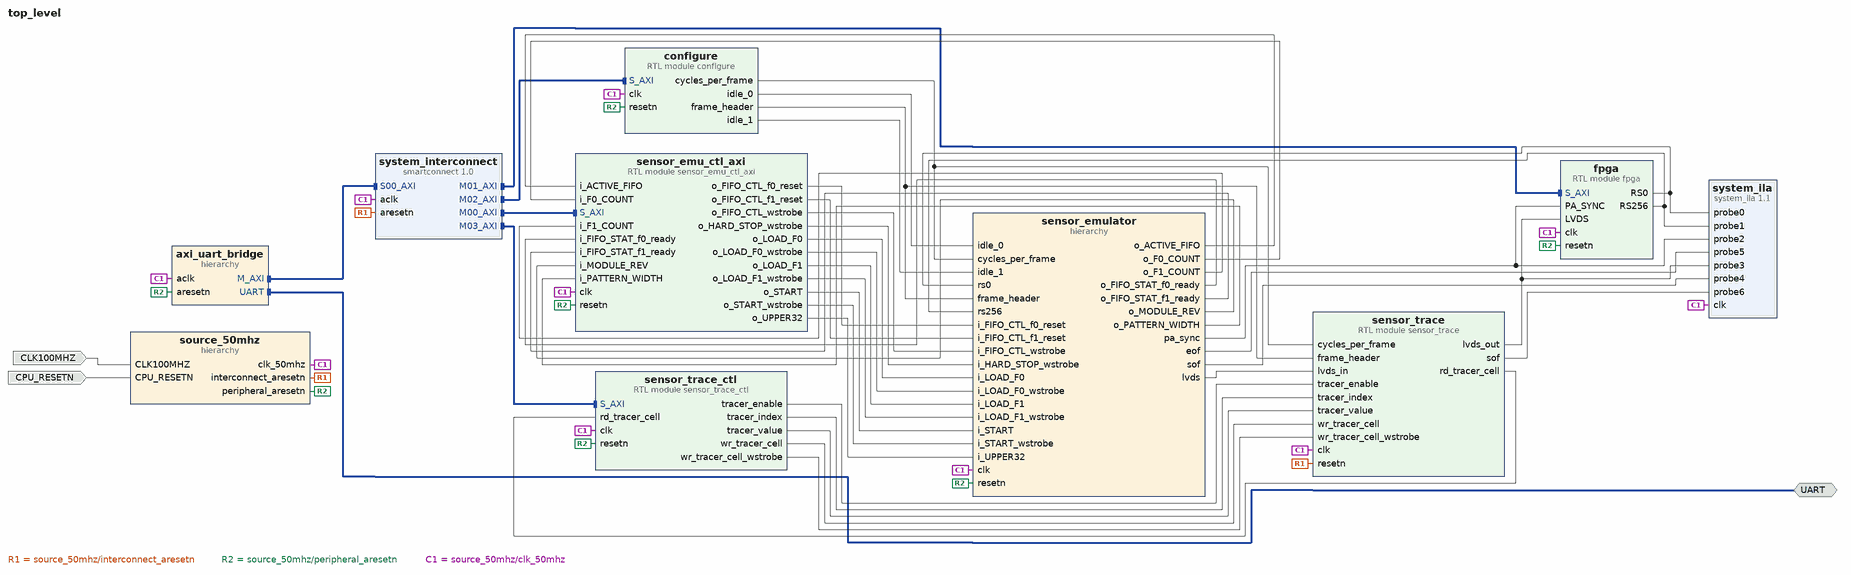
[diagram p0: block diagram of the top level]
# Vivado block design top_level, xc7a100tcsg324-1, Vivado 2021.1
create_bd_design top_level

create_bd_intf_port -mode Master -vlnv xilinx.com:interface:uart_rtl:1.0 UART
create_bd_port -dir I -type clk CLK100MHZ
set_property -dict {CONFIG.ASSOCIATED_RESET CPU_RESETN} [get_bd_ports CLK100MHZ]
create_bd_port -dir I -type rst CPU_RESETN

create_bd_cell -type hier source_50mhz
create_bd_cell -type hier axi_uart_bridge
create_bd_cell -type hier sensor_emulator
create_bd_cell -type module -reference fpga fpga
create_bd_cell -type ip -vlnv xilinx.com:ip:system_ila:1.1 system_ila
set_property -dict [list \
  CONFIG.C_DATA_DEPTH 2048 \
  CONFIG.C_MON_TYPE NATIVE \
  CONFIG.C_NUM_OF_PROBES 7 \
  CONFIG.C_PROBE_WIDTH_PROPAGATION AUTO \
  CONFIG.C_SLOT_0_INTF_TYPE xilinx.com:interface:axis_rtl:1.0 \
] [get_bd_cells system_ila]
create_bd_cell -type module -reference configure configure
create_bd_cell -type module -reference sensor_emu_ctl_axi sensor_emu_ctl_axi
create_bd_cell -type ip -vlnv xilinx.com:ip:smartconnect:1.0 system_interconnect
set_property -dict {CONFIG.NUM_MI 4 CONFIG.NUM_SI 1} [get_bd_cells system_interconnect]
create_bd_cell -type module -reference sensor_trace sensor_trace
create_bd_cell -type module -reference sensor_trace_ctl sensor_trace_ctl

# ---- hierarchy /source_50mhz ----
current_bd_instance /source_50mhz
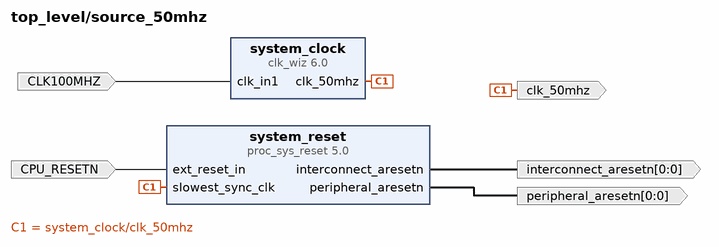
[diagram p1: block diagram inside /source_50mhz]
create_bd_pin -dir I -type clk CLK100MHZ
create_bd_pin -dir O -type clk clk_50mhz
create_bd_pin -dir I -type rst CPU_RESETN
create_bd_pin -dir O -from 0 -to 0 -type rst interconnect_aresetn
create_bd_pin -dir O -from 0 -to 0 -type rst peripheral_aresetn

create_bd_cell -type ip -vlnv xilinx.com:ip:clk_wiz:6.0 system_clock
set_property -dict [list \
  CONFIG.CLKOUT1_DRIVES BUFGCE \
  CONFIG.CLKOUT1_JITTER 151.636 \
  CONFIG.CLKOUT1_REQUESTED_OUT_FREQ 50 \
  CONFIG.CLKOUT2_DRIVES BUFGCE \
  CONFIG.CLKOUT3_DRIVES BUFGCE \
  CONFIG.CLKOUT4_DRIVES BUFGCE \
  CONFIG.CLKOUT5_DRIVES BUFGCE \
  CONFIG.CLKOUT6_DRIVES BUFGCE \
  CONFIG.CLKOUT7_DRIVES BUFGCE \
  CONFIG.CLK_OUT1_PORT clk_50mhz \
  CONFIG.FEEDBACK_SOURCE FDBK_AUTO \
  CONFIG.MMCM_CLKOUT0_DIVIDE_F 20.000 \
  CONFIG.USE_LOCKED false \
  CONFIG.USE_RESET false \
  CONFIG.USE_SAFE_CLOCK_STARTUP true \
] [get_bd_cells system_clock]
create_bd_cell -type ip -vlnv xilinx.com:ip:proc_sys_reset:5.0 system_reset

# ---- hierarchy /axi_uart_bridge ----
current_bd_instance /axi_uart_bridge
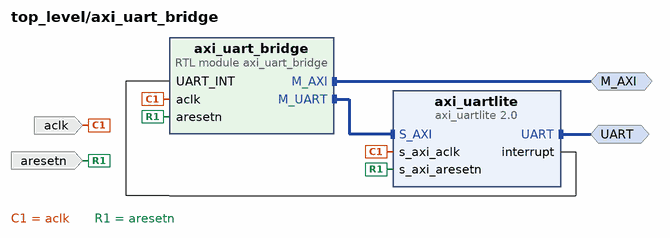
[diagram p2: block diagram inside /axi_uart_bridge]
create_bd_intf_pin -mode Master -vlnv xilinx.com:interface:aximm_rtl:1.0 M_AXI
create_bd_intf_pin -mode Master -vlnv xilinx.com:interface:uart_rtl:1.0 UART
create_bd_pin -dir I -type rst aresetn
create_bd_pin -dir I -type clk aclk

create_bd_cell -type module -reference axi_uart_bridge axi_uart_bridge
create_bd_cell -type ip -vlnv xilinx.com:ip:axi_uartlite:2.0 axi_uartlite
set_property -dict {CONFIG.C_BAUDRATE 115200 CONFIG.C_S_AXI_ACLK_FREQ_HZ 50000000} [get_bd_cells axi_uartlite]

# ---- hierarchy /sensor_emulator ----
current_bd_instance /sensor_emulator
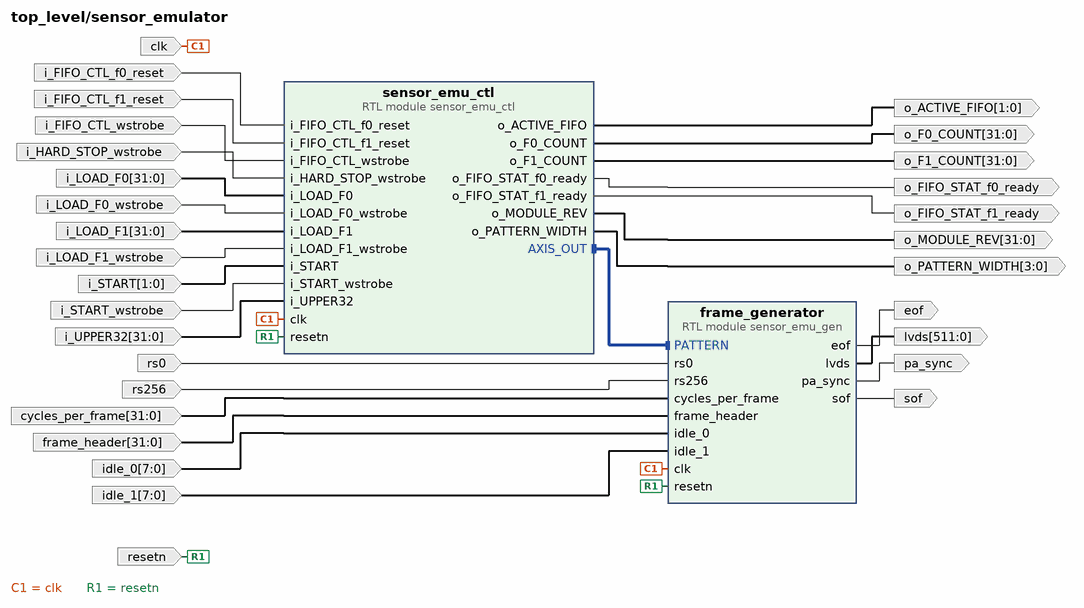
[diagram p3: block diagram inside /sensor_emulator]
create_bd_pin -dir I -type rst resetn
create_bd_pin -dir I -type clk clk
create_bd_pin -dir I rs256
create_bd_pin -dir O pa_sync
create_bd_pin -dir O -from 511 -to 0 lvds
create_bd_pin -dir I rs0
create_bd_pin -dir O sof
create_bd_pin -dir O eof
create_bd_pin -dir I -from 31 -to 0 cycles_per_frame
create_bd_pin -dir I -from 7 -to 0 idle_0
create_bd_pin -dir I -from 7 -to 0 idle_1
create_bd_pin -dir I -from 31 -to 0 frame_header
create_bd_pin -dir I -type rst i_FIFO_CTL_f0_reset
create_bd_pin -dir I -type rst i_FIFO_CTL_f1_reset
create_bd_pin -dir I i_FIFO_CTL_wstrobe
create_bd_pin -dir I -from 31 -to 0 i_UPPER32
create_bd_pin -dir I -from 31 -to 0 i_LOAD_F0
create_bd_pin -dir I i_LOAD_F0_wstrobe
create_bd_pin -dir I -from 31 -to 0 i_LOAD_F1
create_bd_pin -dir I i_LOAD_F1_wstrobe
create_bd_pin -dir I -from 1 -to 0 i_START
create_bd_pin -dir I i_START_wstrobe
create_bd_pin -dir I i_HARD_STOP_wstrobe
create_bd_pin -dir O -from 31 -to 0 o_MODULE_REV
create_bd_pin -dir O -type rst o_FIFO_STAT_f0_ready
create_bd_pin -dir O -type rst o_FIFO_STAT_f1_ready
create_bd_pin -dir O -from 31 -to 0 o_F0_COUNT
create_bd_pin -dir O -from 31 -to 0 o_F1_COUNT
create_bd_pin -dir O -from 1 -to 0 o_ACTIVE_FIFO
create_bd_pin -dir O -from 3 -to 0 o_PATTERN_WIDTH

create_bd_cell -type module -reference sensor_emu_ctl sensor_emu_ctl
create_bd_cell -type module -reference sensor_emu_gen frame_generator

# ---- connections ----

current_bd_instance /source_50mhz
connect_bd_net [get_bd_pins CLK100MHZ] [get_bd_pins system_clock/clk_in1]
connect_bd_net [get_bd_pins CPU_RESETN] [get_bd_pins system_reset/ext_reset_in]
connect_bd_net -net system_clock_clk_100mhz [get_bd_pins system_clock/clk_50mhz] [get_bd_pins clk_50mhz] [get_bd_pins system_reset/slowest_sync_clk]
connect_bd_net [get_bd_pins system_reset/interconnect_aresetn] [get_bd_pins interconnect_aresetn]
connect_bd_net [get_bd_pins system_reset/peripheral_aresetn] [get_bd_pins peripheral_aresetn]

current_bd_instance /axi_uart_bridge
connect_bd_intf_net [get_bd_intf_pins M_AXI] [get_bd_intf_pins axi_uart_bridge/M_AXI]
connect_bd_intf_net [get_bd_intf_pins UART] [get_bd_intf_pins axi_uartlite/UART]
connect_bd_intf_net [get_bd_intf_pins axi_uart_bridge/M_UART] [get_bd_intf_pins axi_uartlite/S_AXI]
connect_bd_net [get_bd_pins aclk] [get_bd_pins axi_uart_bridge/aclk] [get_bd_pins axi_uartlite/s_axi_aclk]
connect_bd_net [get_bd_pins aresetn] [get_bd_pins axi_uart_bridge/aresetn] [get_bd_pins axi_uartlite/s_axi_aresetn]
connect_bd_net [get_bd_pins axi_uartlite/interrupt] [get_bd_pins axi_uart_bridge/UART_INT]

current_bd_instance /sensor_emulator
connect_bd_intf_net -intf_net sensor_emu_ctl_0_AXIS_OUT [get_bd_intf_pins sensor_emu_ctl/AXIS_OUT] [get_bd_intf_pins frame_generator/PATTERN]
connect_bd_net -net LVDS [get_bd_pins frame_generator/lvds] [get_bd_pins lvds]
connect_bd_net -net PA_SYNC [get_bd_pins frame_generator/pa_sync] [get_bd_pins pa_sync]
connect_bd_net [get_bd_pins rs0] [get_bd_pins frame_generator/rs0]
connect_bd_net [get_bd_pins rs256] [get_bd_pins frame_generator/rs256]
connect_bd_net [get_bd_pins clk] [get_bd_pins sensor_emu_ctl/clk] [get_bd_pins frame_generator/clk]
connect_bd_net -net cycles_per_frame1_1 [get_bd_pins cycles_per_frame] [get_bd_pins frame_generator/cycles_per_frame]
connect_bd_net [get_bd_pins frame_generator/eof] [get_bd_pins eof]
connect_bd_net [get_bd_pins frame_generator/sof] [get_bd_pins sof]
connect_bd_net [get_bd_pins frame_header] [get_bd_pins frame_generator/frame_header]
connect_bd_net [get_bd_pins i_FIFO_CTL_f0_reset] [get_bd_pins sensor_emu_ctl/i_FIFO_CTL_f0_reset]
connect_bd_net [get_bd_pins i_FIFO_CTL_f1_reset] [get_bd_pins sensor_emu_ctl/i_FIFO_CTL_f1_reset]
connect_bd_net [get_bd_pins i_FIFO_CTL_wstrobe] [get_bd_pins sensor_emu_ctl/i_FIFO_CTL_wstrobe]
connect_bd_net [get_bd_pins i_HARD_STOP_wstrobe] [get_bd_pins sensor_emu_ctl/i_HARD_STOP_wstrobe]
connect_bd_net -net i_LOAD_F0_1 [get_bd_pins i_LOAD_F0] [get_bd_pins sensor_emu_ctl/i_LOAD_F0]
connect_bd_net [get_bd_pins i_LOAD_F0_wstrobe] [get_bd_pins sensor_emu_ctl/i_LOAD_F0_wstrobe]
connect_bd_net -net i_LOAD_F1_1 [get_bd_pins i_LOAD_F1] [get_bd_pins sensor_emu_ctl/i_LOAD_F1]
connect_bd_net [get_bd_pins i_LOAD_F1_wstrobe] [get_bd_pins sensor_emu_ctl/i_LOAD_F1_wstrobe]
connect_bd_net [get_bd_pins i_START] [get_bd_pins sensor_emu_ctl/i_START]
connect_bd_net [get_bd_pins i_START_wstrobe] [get_bd_pins sensor_emu_ctl/i_START_wstrobe]
connect_bd_net -net i_UPPER32_1 [get_bd_pins i_UPPER32] [get_bd_pins sensor_emu_ctl/i_UPPER32]
connect_bd_net -net idle_0_1 [get_bd_pins idle_0] [get_bd_pins frame_generator/idle_0]
connect_bd_net -net idle_1_1 [get_bd_pins idle_1] [get_bd_pins frame_generator/idle_1]
connect_bd_net [get_bd_pins resetn] [get_bd_pins sensor_emu_ctl/resetn] [get_bd_pins frame_generator/resetn]
connect_bd_net [get_bd_pins sensor_emu_ctl/o_ACTIVE_FIFO] [get_bd_pins o_ACTIVE_FIFO]
connect_bd_net [get_bd_pins sensor_emu_ctl/o_F0_COUNT] [get_bd_pins o_F0_COUNT]
connect_bd_net [get_bd_pins sensor_emu_ctl/o_F1_COUNT] [get_bd_pins o_F1_COUNT]
connect_bd_net -net sensor_emu_ctl_o_FIFO_STAT_f0_reset [get_bd_pins sensor_emu_ctl/o_FIFO_STAT_f0_ready] [get_bd_pins o_FIFO_STAT_f0_ready]
connect_bd_net -net sensor_emu_ctl_o_FIFO_STAT_f1_reset [get_bd_pins sensor_emu_ctl/o_FIFO_STAT_f1_ready] [get_bd_pins o_FIFO_STAT_f1_ready]
connect_bd_net [get_bd_pins sensor_emu_ctl/o_MODULE_REV] [get_bd_pins o_MODULE_REV]
connect_bd_net [get_bd_pins sensor_emu_ctl/o_PATTERN_WIDTH] [get_bd_pins o_PATTERN_WIDTH]

current_bd_instance /
connect_bd_intf_net -intf_net hier_0_M_AXI [get_bd_intf_pins system_interconnect/S00_AXI] [get_bd_intf_pins axi_uart_bridge/M_AXI]
connect_bd_intf_net -intf_net hier_0_UART [get_bd_intf_ports UART] [get_bd_intf_pins axi_uart_bridge/UART]
connect_bd_intf_net [get_bd_intf_pins system_interconnect/M00_AXI] [get_bd_intf_pins sensor_emu_ctl_axi/S_AXI]
connect_bd_intf_net [get_bd_intf_pins system_interconnect/M01_AXI] [get_bd_intf_pins fpga/S_AXI]
connect_bd_intf_net [get_bd_intf_pins system_interconnect/M02_AXI] [get_bd_intf_pins configure/S_AXI]
connect_bd_intf_net [get_bd_intf_pins system_interconnect/M03_AXI] [get_bd_intf_pins sensor_trace_ctl/S_AXI]
connect_bd_net [get_bd_ports CLK100MHZ] [get_bd_pins source_50mhz/CLK100MHZ]
connect_bd_net [get_bd_ports CPU_RESETN] [get_bd_pins source_50mhz/CPU_RESETN]
connect_bd_net -net EOF [get_bd_pins sensor_emulator/eof] [get_bd_pins system_ila/probe5]
connect_bd_net -net PA_SYNC [get_bd_pins sensor_emulator/pa_sync] [get_bd_pins fpga/PA_SYNC] [get_bd_pins system_ila/probe2]
connect_bd_net -net RS0 [get_bd_pins fpga/RS0] [get_bd_pins sensor_emulator/rs0] [get_bd_pins system_ila/probe0]
connect_bd_net -net RS256 [get_bd_pins fpga/RS256] [get_bd_pins sensor_emulator/rs256] [get_bd_pins system_ila/probe1]
connect_bd_net -net SOF [get_bd_pins sensor_emulator/sof] [get_bd_pins system_ila/probe4]
connect_bd_net -net configure_0_cycles_per_frame [get_bd_pins configure/cycles_per_frame] \
  [get_bd_pins sensor_emulator/cycles_per_frame] [get_bd_pins sensor_trace/cycles_per_frame]
connect_bd_net -net configure_0_frame_header [get_bd_pins configure/frame_header] \
  [get_bd_pins sensor_emulator/frame_header] [get_bd_pins sensor_trace/frame_header]
connect_bd_net -net configure_0_idle_0 [get_bd_pins configure/idle_0] [get_bd_pins sensor_emulator/idle_0]
connect_bd_net -net configure_0_idle_1 [get_bd_pins configure/idle_1] [get_bd_pins sensor_emulator/idle_1]
connect_bd_net [get_bd_pins sensor_emu_ctl_axi/o_FIFO_CTL_f0_reset] [get_bd_pins sensor_emulator/i_FIFO_CTL_f0_reset]
connect_bd_net [get_bd_pins sensor_emu_ctl_axi/o_FIFO_CTL_f1_reset] [get_bd_pins sensor_emulator/i_FIFO_CTL_f1_reset]
connect_bd_net [get_bd_pins sensor_emu_ctl_axi/o_FIFO_CTL_wstrobe] [get_bd_pins sensor_emulator/i_FIFO_CTL_wstrobe]
connect_bd_net [get_bd_pins sensor_emu_ctl_axi/o_HARD_STOP_wstrobe] [get_bd_pins sensor_emulator/i_HARD_STOP_wstrobe]
connect_bd_net [get_bd_pins sensor_emu_ctl_axi/o_LOAD_F0] [get_bd_pins sensor_emulator/i_LOAD_F0]
connect_bd_net [get_bd_pins sensor_emu_ctl_axi/o_LOAD_F0_wstrobe] [get_bd_pins sensor_emulator/i_LOAD_F0_wstrobe]
connect_bd_net [get_bd_pins sensor_emu_ctl_axi/o_LOAD_F1] [get_bd_pins sensor_emulator/i_LOAD_F1]
connect_bd_net [get_bd_pins sensor_emu_ctl_axi/o_LOAD_F1_wstrobe] [get_bd_pins sensor_emulator/i_LOAD_F1_wstrobe]
connect_bd_net [get_bd_pins sensor_emu_ctl_axi/o_START] [get_bd_pins sensor_emulator/i_START]
connect_bd_net [get_bd_pins sensor_emu_ctl_axi/o_START_wstrobe] [get_bd_pins sensor_emulator/i_START_wstrobe]
connect_bd_net [get_bd_pins sensor_emu_ctl_axi/o_UPPER32] [get_bd_pins sensor_emulator/i_UPPER32]
connect_bd_net [get_bd_pins sensor_emulator/lvds] [get_bd_pins sensor_trace/lvds_in]
connect_bd_net [get_bd_pins sensor_emulator/o_ACTIVE_FIFO] [get_bd_pins sensor_emu_ctl_axi/i_ACTIVE_FIFO]
connect_bd_net [get_bd_pins sensor_emulator/o_F0_COUNT] [get_bd_pins sensor_emu_ctl_axi/i_F0_COUNT]
connect_bd_net [get_bd_pins sensor_emulator/o_F1_COUNT] [get_bd_pins sensor_emu_ctl_axi/i_F1_COUNT]
connect_bd_net [get_bd_pins sensor_emulator/o_FIFO_STAT_f0_ready] [get_bd_pins sensor_emu_ctl_axi/i_FIFO_STAT_f0_ready]
connect_bd_net [get_bd_pins sensor_emulator/o_FIFO_STAT_f1_ready] [get_bd_pins sensor_emu_ctl_axi/i_FIFO_STAT_f1_ready]
connect_bd_net [get_bd_pins sensor_emulator/o_MODULE_REV] [get_bd_pins sensor_emu_ctl_axi/i_MODULE_REV]
connect_bd_net [get_bd_pins sensor_emulator/o_PATTERN_WIDTH] [get_bd_pins sensor_emu_ctl_axi/i_PATTERN_WIDTH]
connect_bd_net [get_bd_pins sensor_trace_ctl/tracer_enable] [get_bd_pins sensor_trace/tracer_enable]
connect_bd_net [get_bd_pins sensor_trace_ctl/tracer_index] [get_bd_pins sensor_trace/tracer_index]
connect_bd_net [get_bd_pins sensor_trace_ctl/tracer_value] [get_bd_pins sensor_trace/tracer_value]
connect_bd_net [get_bd_pins sensor_trace_ctl/wr_tracer_cell] [get_bd_pins sensor_trace/wr_tracer_cell]
connect_bd_net [get_bd_pins sensor_trace_ctl/wr_tracer_cell_wstrobe] [get_bd_pins sensor_trace/wr_tracer_cell_wstrobe]
connect_bd_net [get_bd_pins sensor_trace/lvds_out] [get_bd_pins fpga/LVDS] [get_bd_pins system_ila/probe3]
connect_bd_net [get_bd_pins sensor_trace/rd_tracer_cell] [get_bd_pins sensor_trace_ctl/rd_tracer_cell]
connect_bd_net [get_bd_pins sensor_trace/sof] [get_bd_pins system_ila/probe6]
connect_bd_net -net source_100mhz_interconnect_aresetn [get_bd_pins source_50mhz/interconnect_aresetn] \
  [get_bd_pins system_interconnect/aresetn] [get_bd_pins sensor_trace/resetn]
connect_bd_net -net source_100mhz_peripheral_aresetn [get_bd_pins source_50mhz/peripheral_aresetn] \
  [get_bd_pins axi_uart_bridge/aresetn] [get_bd_pins sensor_emulator/resetn] [get_bd_pins fpga/resetn] \
  [get_bd_pins configure/resetn] [get_bd_pins sensor_emu_ctl_axi/resetn] [get_bd_pins sensor_trace_ctl/resetn]
connect_bd_net -net system_clock_clk_100mhz [get_bd_pins source_50mhz/clk_50mhz] \
  [get_bd_pins axi_uart_bridge/aclk] [get_bd_pins sensor_emulator/clk] [get_bd_pins fpga/clk] [get_bd_pins system_ila/clk] \
  [get_bd_pins configure/clk] [get_bd_pins sensor_emu_ctl_axi/clk] [get_bd_pins system_interconnect/aclk] \
  [get_bd_pins sensor_trace/clk] [get_bd_pins sensor_trace_ctl/clk]

# ---- address map ----
assign_bd_address -offset 0x0000000000001000 -range 128 -target_address_space [get_bd_addr_spaces axi_uart_bridge/axi_uart_bridge/M_AXI] [get_bd_addr_segs sensor_emu_ctl_axi/S_AXI/reg0]
assign_bd_address -offset 0x0000000000002000 -range 128 -target_address_space [get_bd_addr_spaces axi_uart_bridge/axi_uart_bridge/M_AXI] [get_bd_addr_segs fpga/S_AXI/reg0]
assign_bd_address -offset 0x0000000000003000 -range 128 -target_address_space [get_bd_addr_spaces axi_uart_bridge/axi_uart_bridge/M_AXI] [get_bd_addr_segs configure/S_AXI/reg0]
assign_bd_address -offset 0x0000000000004000 -range 128 -target_address_space [get_bd_addr_spaces axi_uart_bridge/axi_uart_bridge/M_AXI] [get_bd_addr_segs sensor_trace_ctl/S_AXI/reg0]
assign_bd_address -offset 0x40600000 -range 64K -target_address_space [get_bd_addr_spaces axi_uart_bridge/axi_uart_bridge/M_UART] [get_bd_addr_segs axi_uart_bridge/axi_uartlite/S_AXI/Reg]

validate_bd_design
save_bd_design
